# Altium schematic sheet main.SchDoc
size A4
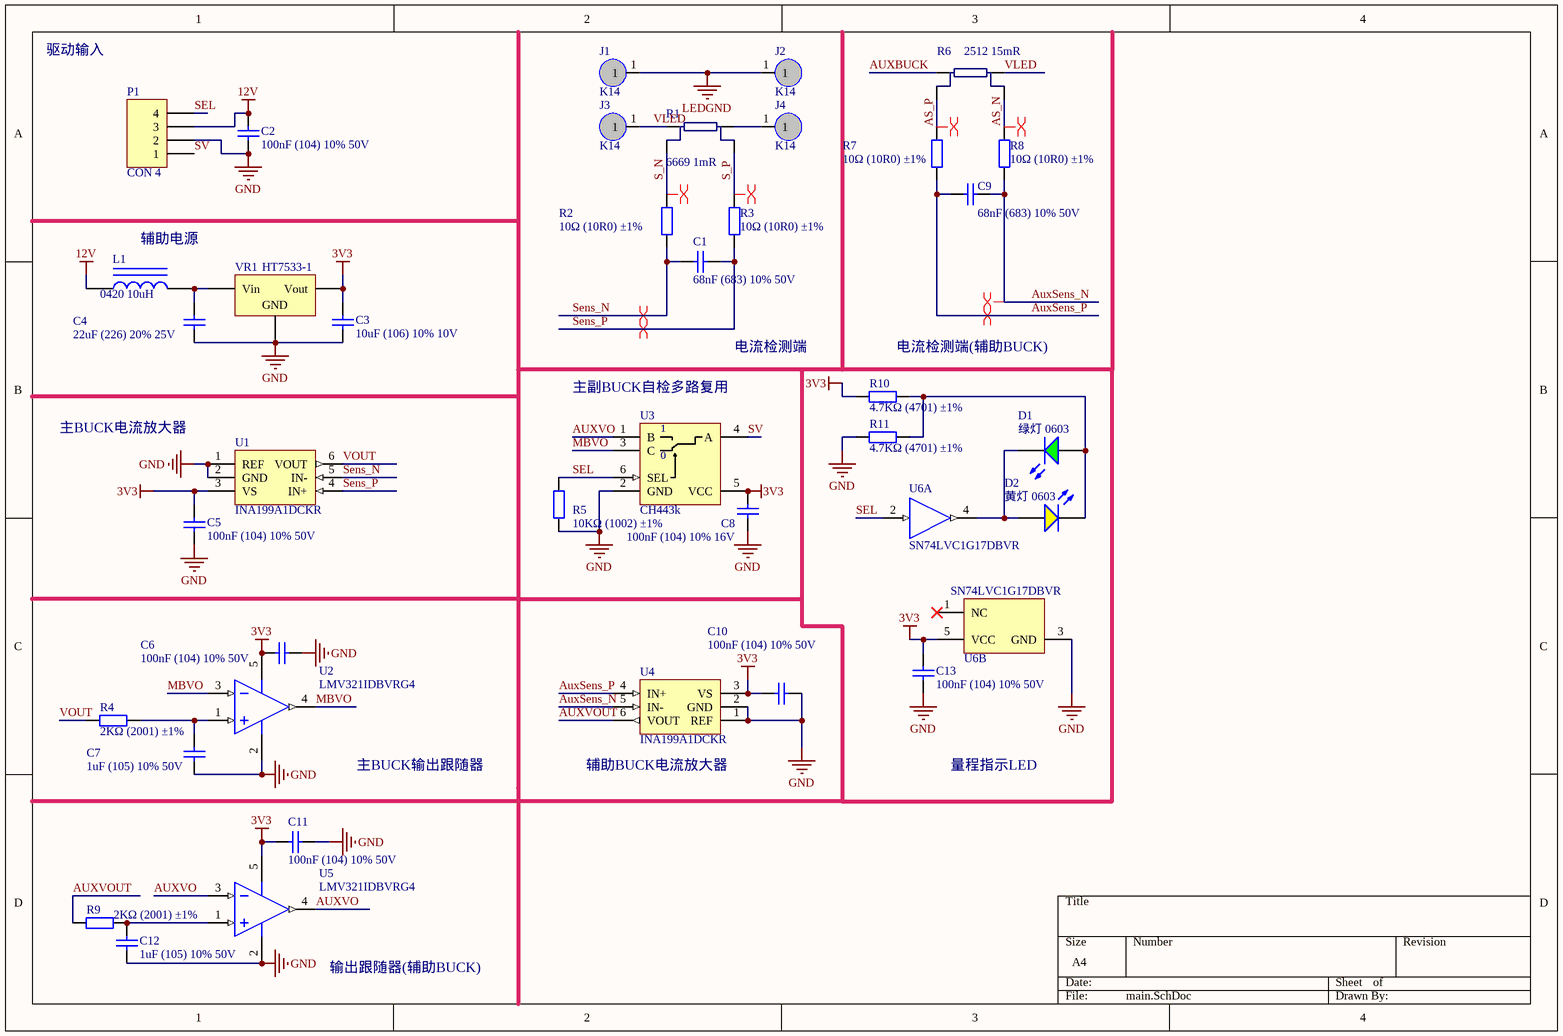
[diagram p0: main.SchDoc]

## Parts
C1  68nF (683) 10% 50V  [0603_C]
C2  100nF (104) 10% 50V  [0603_C]
C3  10uF (106) 10% 10V  [0603_C]
C4  22uF (226) 20% 25V  [0805_C]
C5  100nF (104) 10% 50V  [0603_C]
C6  100nF (104) 10% 50V  [0603_C]
C7  1uF (105) 10% 50V  [0603_C]
C8  100nF (104) 10% 16V  [0402_C]
C9  68nF (683) 10% 50V  [0603_C]
C10  100nF (104) 10% 50V  [0603_C]
C11  100nF (104) 10% 50V  [0603_C]
C12  1uF (105) 10% 50V  [0603_C]
C13  100nF (104) 10% 50V  [0603_C]
D1  绿灯 0603  [0603_LED_S1]
D2  黄灯 0603  [0603_LED_S1]
J1  K14  [k14端子]
J2  K14  [k14端子]
J3  K14  [k14端子]
J4  K14  [k14端子]
L1  0420  value 10uH  [IND0420]
P1  CON 4  [KF2EDGR5.08/4]
R1  6669 1mR  [Shunt6669]
R2  10Ω (10R0) ±1%  [0603_R]
R3  10Ω (10R0) ±1%  [0603_R]
R4  2KΩ (2001) ±1%  [0603_R]
R5  10KΩ (1002) ±1%  [0402_R]
R6  2512 15mR  [2512-Virtual4Wire]
R7  10Ω (10R0) ±1%  [0603_R]
R8  10Ω (10R0) ±1%  [0603_R]
R9  2KΩ (2001) ±1%  [0603_R]
R10  4.7KΩ (4701) ±1%  [0603_R]
R11  4.7KΩ (4701) ±1%  [0603_R]
U1  INA199A1DCKR  [SC70-6]
U2  LMV321IDBVRG4  [SOT-23-5]
U3  CH443k  [SC70-6]
U4  INA199A1DCKR  [SC70-6]
U5  LMV321IDBVRG4  [SOT-23-5]
U6  SN74LVC1G17DBVR  [DBV0005A_N]  (parts A,B of 2)
VR1  HT7533-1  [SOT-89(SOT-89-3)]

## Nets
3V3: C3.2 C5.2 C6.1 C8.2 C10.2 C11.1 C13.2 R10.2 U1.3(VS) U2.5(V+) U3.5(VCC) U4.3(VS) U5.5(V+) U6.5(VCC) VR1.3(Vout)
12V: C2.2 L1.1 P1.3
GND: C2.1 C3.1 C4.1 C5.1 C6.2 C7.1 C8.1 C10.1 C11.2 C12.1 C13.1 P1.2 R5.1 R11.2 U1.1(REF) U1.2(GND) U2.2(V-) U3.2(GND) U4.1(REF) U4.2(GND) U5.2(V-) U6.3(GND) VR1.1(GND)
LEDGND: J1.1 J2.1
AS_N: R6.3(CIN) R8.2
AS_P: R6.2(CIN) R7.2
AUXBUCK: R6.0(CIN)
AuxSens_N: C9.2 R8.1 U4.5(IN-)
AuxSens_P: C9.1 R7.1 U4.4(IN+)
AUXVO: U3.1(B) U5.3(IN-) U5.4(OUT)
AUXVOUT: R9.1 U4.6(VOUT)
MBVO: U2.3(IN-) U2.4(OUT) U3.3(C)
S_N: R1.2(CIN) R2.2
S_P: R1.3(CIN) R3.2
SEL: P1.4 R5.2 U3.6(SEL) U6.2(A)
Sens_N: C1.1 R2.1 U1.5(IN-)
Sens_P: C1.2 R3.1 U1.4(IN+)
SV: P1.1 U3.4(A)
VLED: J3.1 R1.0(CIN) R6.1(CIN)
VOUT: R4.1 U1.6(VOUT)
NetC4_2: C4.2 L1.2 VR1.2(Vin)
NetC7_2: C7.2 R4.2 U2.1(IN+)
NetC12_2: C12.2 R9.2 U5.1(IN+)
NetD1_A: D1.A D2.K R10.1 R11.1
NetD1_K: D1.K D2.A U6.4(Y)
NetJ4_1: J4.1 R1.1(CIN)

Not connected (* = marked no-connect by the designer): U6 1(NC)*

## Layout directives
differential pair: AS_N, AS_P, AuxSens_N, AuxSens_P, S_N, S_P, Sens_N, Sens_P

## Notes on the sheet
- 驱动输入
- (near L1) 辅助电源
- 电流检测端
- (near R10) 电流检测端(辅助BUCK)
- 主BUCK电流放大器
- (near U3) 主副BUCK自检多路复用
- 主BUCK输出跟随器
- (near U4) 辅助BUCK电流放大器
- 量程指示LED
- (near U5) 输出跟随器(辅助BUCK)
- (in symbol NC7SB3157P6X) 0

## Library data of the parts
C1 C9 = 0603 68nF (683) 10% 50V: 贴片电容; ComponentLink1Description: 供应商链接; ComponentLink1URL: http://www.szlcsc.com/product/details_32617.html; Package: 0603; Supplier: LC; SuppliersPartNumber: C31658
C2 C5 C6 C10 C11 C13 = 0603 100nF (104) 10% 50V: 贴片电容; ComponentLink1Description: 供应商链接; ComponentLink1URL: http://www.szlcsc.com/product/details_15331.html; Package: 0603; Supplier: LC; SuppliersPartNumber: C14663
C3 = 0603 10uF (106) 10% 10V: 贴片电容; ComponentLink1Description: 供应商链接; ComponentLink1URL: http://www.szlcsc.com/product/details_20411.html; Package: 0603; Supplier: LC; SuppliersPartNumber: C19702
C4 = 0805 22uF (226) 20% 25V: 贴片电容; ComponentLink1Description: 供应商链接; ComponentLink1URL: http://www.szlcsc.com/product/details_46786.html; Package: 0805; Supplier: LC; SuppliersPartNumber: C45783
C7 C12 = 0603 1uF (105) 10% 50V: 贴片电容; ComponentLink1Description: 供应商链接; ComponentLink1URL: http://www.szlcsc.com/product/details_16531.html; Package: 0603; Supplier: LC; SuppliersPartNumber: C15849
C8 = 0402 100nF (104) 10% 16V: 贴片电容; ComponentLink1Description: 供应商链接; ComponentLink1URL: http://www.szlcsc.com/product/details_1877.html; Package: 0402; Supplier: LC; SuppliersPartNumber: C1525
D1 = 0603 绿灯: 发光二极管; ComponentLink1Description: 供应商链接; ComponentLink1URL: http://www.szlcsc.com/product/details_73152.html; Package: 0603; Supplier: LC; SuppliersPartNumber: C72043
D2 = 0603 黄灯: 发光二极管; ComponentLink1Description: 供应商链接; ComponentLink1URL: http://www.szlcsc.com/product/details_73147.html; Package: 0603; Supplier: LC; SuppliersPartNumber: C72038
J1-J4 = Con 1
L1 = Inductor Iron: Magnetic-Core Inductor; Published: 24-Mar-1999; LatestRevisionDate: 17-Jul-2002; LatestRevisionNote: Re-released for DXP Platform.; PackageReference: AXIAL-0.9; Publisher: Altium Limited; PackageDescription: Axial Device, Thru-Hole; 2 Leads; 0.9 in Pin Spacing
P1 = CON 4: 4-Pin; LatestRevisionDate: 17-Jul-2002; LatestRevisionNote: Re-released for DXP Platform.; Publisher: Altium Limited
R1 = shunt: 4wire shunt 6669 1mR
R2 R3 R7 R8 = 0603 10Ω (10R0) 1%: 贴片电阻; ComponentLink1Description: 供应商链接; ComponentLink1URL: http://www.szlcsc.com/product/details_23586.html; Package: 0603; Supplier: LC; SuppliersPartNumber: C22859
R4 R9 = 0603 2KΩ (2001) 1%: 贴片电阻; ComponentLink1Description: 供应商链接; ComponentLink1URL: http://www.szlcsc.com/product/details_23702.html; Package: 0603; Supplier: LC; SuppliersPartNumber: C22975
R5 = 0402 10KΩ (1002) 1%: 贴片电阻; ComponentLink1Description: 供应商链接; ComponentLink1URL: http://www.szlcsc.com/product/details_26487.html; Package: 0402; Supplier: LC; SuppliersPartNumber: C25744
R6 = shunt: 2512检流电阻 15mR
R10 R11 = 0603 4.7KΩ (4701) 1%: 贴片电阻; ComponentLink1Description: 供应商链接; ComponentLink1URL: http://www.szlcsc.com/product/details_23889.html; Package: 0603; Supplier: LC; SuppliersPartNumber: C23162
U1 U4 = INA199A2DCKR: 50Khz 50V/V 26V Max High Side Current Op Amp.
U2 U5 = LMV321IDBVRG4_[C7972]: 运放; ComponentLink1Description: 供应商链接; ComponentLink1URL: http://www.szlcsc.com/product/details_8449.html; Package: SOT-23-5; Supplier: LC; SuppliersPartNumber: C7972
U3 = NC7SB3157P6X: Low-Voltage Analog Switch SPDT,1.8-5V Power
U6 = SN74LVC1G17DBVR: Single Schmitt-Trigger Buffer, DBV0005A, LARGE T&R; Manufacturer: Texas Instruments; VCC(Min)(V): 1.65; VCC(Max)(V): 5.5; Output Type: CMOS; ICC @ Nom Voltage(Max)(mA): 0.01; Input Type: CMOS/TTL; Bits(#): 1; F @ Nom Voltage(Max)(Mhz): 150; Rating: Catalog; Technology Family: LVC; Voltage(Nom)(V): 1.8,2.5,3.3,5; Schmitt Trigger: Yes; Output Drive (IOL/IOH)(Max)(mA): 32/-32; tpd @ Nom Voltage(Max)(ns): 11,6.5,5.5,5; Logic: True; Sub-Family: Non-Inverting Buffer/Driver; 3-State Output: No; DatasheetVersion: SCES351V; PackageReference: DBV0005A; Supplier 1: Mouser; Supplier Part Number 1: 595-SN74LVC1G17DBVR; Supplier 2: Digi-Key; Supplier Part Number 2: 296-11933-2-ND; Supplier 3: Digi-Key; Supplier Part Number 3: 296-11933-1-ND; Supplier 4: Digi-Key; Supplier Part Number 4: 296-11933-6-ND; Generic Part Number: SN74LVC1G17; Operating Temperature Range(C): -40 to 125,-40 to 85; PartNumber: SN74LVC1G17DBVR; ComponentLink1Description: Manufacturer URL; ComponentLink1URL: http://www.ti.com/; ComponentLink2Description: Datasheet; ComponentLink2URL: http://www.ti.com/lit/ds/symlink/sn74lvc1g17.pdf
VR1 = SOT-89 HT7533-1: 低压差线性稳压(LDO); ComponentLink1Description: 供应商链接; ComponentLink1URL: http://www.szlcsc.com/product/details_14949.html; Package: SOT-89; Supplier: LC; SuppliersPartNumber: C14289